# Altium schematic sheet ConnectorInterface.SchDoc
size 215 x 279 mm; SheetNumber: 1; SheetTotal: 4
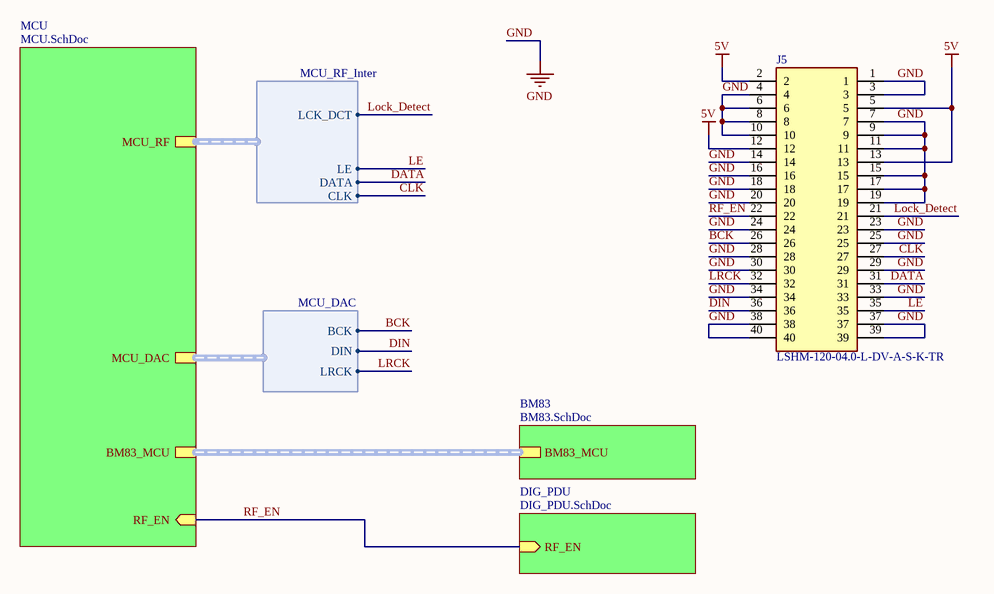
[diagram p0: ConnectorInterface.SchDoc]

## Parts
J5  LSHM-120-04.0-L-DV-A-S-K-TR  [LSHM-120-XX.X-YYY-DV-A-S-K-TR]

## Sub-sheets
BM83 = BM83.SchDoc: BM83_MCU (harness BM83_MCU)
DIG_PDU = DIG_PDU.SchDoc: RF_EN (in)
MCU = MCU.SchDoc: BM83_MCU (harness BM83_MCU), MCU_RF (harness MCU_RF_Inter), MCU_DAC (harness MCU_DAC), RF_EN (in)

## Harnesses
MCU_RF_Inter: LCK_DCT, LE, DATA, CLK
MCU_DAC: BCK, DIN, LRCK

## Nets
5V: J5.2 J5.5 J5.12 J5.13
GND: J5.1 J5.3 J5.4 J5.6 J5.7 J5.8 J5.9 J5.10 J5.11 J5.14 J5.15 J5.16 J5.17 J5.18 J5.19 J5.20 J5.23 J5.24 J5.25 J5.28 J5.29 J5.30 J5.33 J5.34 J5.37 J5.38 J5.39 J5.40
BCK: J5.26 ; sheet MCU/MCU_DAC.BCK
CLK: J5.27 ; sheet MCU/MCU_RF.CLK
DATA: J5.31 ; sheet MCU/MCU_RF.DATA
DIN: J5.36 ; sheet MCU/MCU_DAC.DIN
LE: J5.35 ; sheet MCU/MCU_RF.LE
Lock_Detect: J5.21 ; sheet MCU/MCU_RF.LCK_DCT
LRCK: J5.32 ; sheet MCU/MCU_DAC.LRCK
RF_EN: J5.22 ; sheet DIG_PDU/RF_EN, sheet MCU/RF_EN

## Buses and harness runs
harness sheet BM83/BM83_MCU = sheet MCU/BM83_MCU

## Notes on the sheet
- Contents
- Revision Notes

## Library data of the parts
J5 = LSHM-120-04.0-L-DV-A-S-K-TR: Connector; Manufacturer_Name: SAMTEC; Datasheet Link: http://suddendocs.samtec.com/prints/lshm-1xx-xx.x-xxx-dv-a-x-x-xx-mkt.pdf; Manufacturer_Part_Number: LSHM-120-04.0-L-DV-A-S-K-TR; Mouser Part Number: 200-LSHM12004LDVASK; Mouser Price/Stock: https://www.mouser.co.uk/ProductDetail/Samtec/LSHM-120-040-L-DV-A-S-K-TR?qs=PB6%2FjmICvI1v5WBlLc04lg%3D%3D; Arrow Part Number: LSHM-120-04.0-L-DV-A-S-K-TR; Arrow Price/Stock: https://www.arrow.com/en/products/lshm-120-04.0-l-dv-a-sktr/samtec?region=nac